# Altium schematic sheet thermokoppel.SchDoc
size A4; SheetNumber: 2; SheetTotal: 5
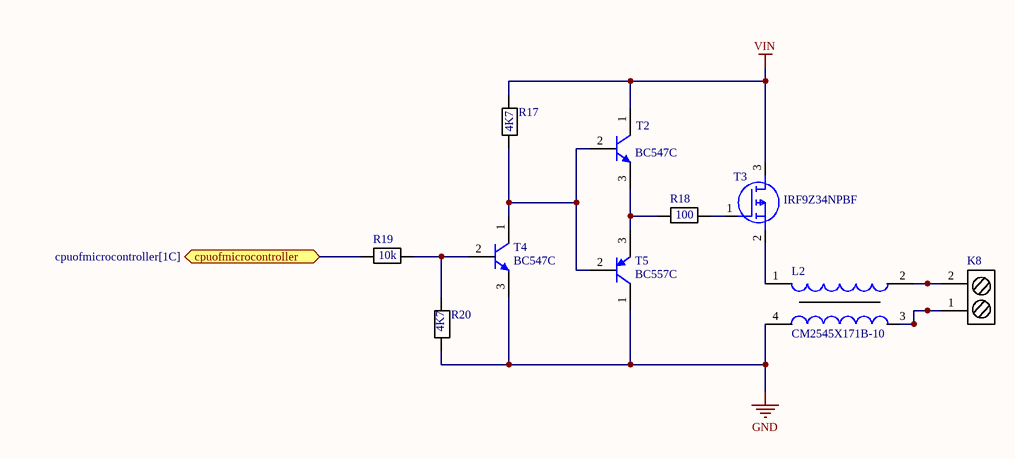
[diagram p0: thermokoppel.SchDoc]

## Parts
K8  (no value)  [printkroonsteen 2pin]
L2  CM2545X171B-10  [CM2545X171B10]
R17  4K7  [RESC2013X50X30LL20T20]
R18  100  [RESC2013X50X30LL20T20]
R19  10k  [RESC2013X50X30LL20T20]
R20  4K7  [RESC2013X50X30LL20T20]
T2  BC547C  [ONSC-TO-92-3-29-11]
T3  IRF9Z34NPBF  [TO254P469X1042X1967-3P]
T4  BC547C  [ONSC-TO-92-3-29-11]
T5  BC557C  [ONSC-TO-92-3-29-11]

## Ports
cpuofmicrocontroller (bidir, see cpuofmicrocontroller[1C])

## Nets
GND: L2.4 R20.2 T4.3(E) T5.1(C)
VIN: R17.1 T2.1(C) T3.3(D)
cpuofmicrocontroller: R19.1 ; port cpuofmicrocontroller
NetK8_1: K8.1 L2.3
NetK8_2: K8.2 L2.2
NetL2_1: L2.1 T3.2(S)
NetR17_2: R17.2 T2.2(B) T4.1(C) T5.2(B)
NetR18_1: R18.1 T2.3(E) T5.3(E)
NetR18_2: R18.2 T3.1(G)
NetR19_2: R19.2 R20.1 T4.2(B)

## Library data of the parts
K8 = printkroonsteen 2pin
L2 = CM2545X171B-10: Transformer; Manufacturer_Name: Laird Technologies; Datasheet Link: https://datasheet.datasheetarchive.com/originals/dk/DKDS-7/122753.pdf; Height: 9.5mm; Manufacturer_Part_Number: CM2545X171B-10; Mouser Part Number: N/A; Mouser Price/Stock: https://www.mouser.co.uk/ProductDetail/Laird/CM2545X171B-10?qs=PzGy0jfpSMtNfkEypgU65A%3D%3D; Arrow Part Number: CM2545X171B-10; Arrow Price/Stock: https://www.arrow.com/en/products/cm2545x171b-10/laird-technologies
R17-R20 = weerstand: Manufacturer: Vishay Dale; Part Number: CRCW08050000Z0EA
T2 T4 = BC547C: Amplifier Transistor, NPN Silicon, 3-Pin TO-92, Bulk Box; Manufacturer: On Semiconductor; IC Continuous (A): 0.1; fT Min (MHz): 150; Mounting Technology: Through Hole; ComponentLink1URL: http://www.onsemi.com/; ComponentLink1Description: Manufacturer URL; ComponentLink3URL: http://www.onsemi.cn/pub_link/Collateral/2N6426-D.PDF; DatasheetVersion: Rev. 7; PackageVersion: Rev. AM; Packing: Bulk Box; RoHS: FALSE; Polarity: NPN; PartNumber: BC547C; ComponentLink2URL: http://www.onsemi.com/pub_link/Collateral/BC546-D.PDF; ComponentLink3Description: Package Specification; PackageDescription: 3-Pin Transistor Outline, Body 4.825 x 3.685 mm, Pitch 1.27 mm; PackageReference: TO-92-3-29-11_AM_SL; ComponentLink2Description: Datasheet
T3 = IRF9Z34NPBF: MOSFET (P-Channel); Manufacturer_Name: Infineon; Datasheet Link: https://www.infineon.com/dgdl/irf9z34npbf.pdf?fileId=5546d462533600a40153561220af1ddd; Height: 4.69mm; Manufacturer_Part_Number: IRF9Z34NPBF; Mouser Part Number: 942-IRF9Z34NPBF; Mouser Price/Stock: https://www.mouser.co.uk/ProductDetail/Infineon-Technologies/IRF9Z34NPBF?qs=9%252BKlkBgLFf16a%2FvlD%252BMCtQ%3D%3D; Arrow Part Number: IRF9Z34NPBF; Arrow Price/Stock: https://www.arrow.com/en/products/irf9z34npbf/infineon-technologies-ag?region=nac
T5 = BC557C: Amplifier Transistor, PNP Silicon, 3-Pin TO-92, Bulk Box; Manufacturer: On Semiconductor; IC Continuous (A): -0.1; Polarity: PNP; PartNumber: BC557C; PackageVersion: Rev. AM; RoHS: FALSE; PackageDescription: 3-Pin Transistor Outline, Body 4.825 x 3.685 mm, Pitch 1.27 mm; Packing: Bulk Box; ComponentLink2Description: Datasheet; DatasheetVersion: Rev. 3; ComponentLink3Description: Package Specification; Mounting Technology: Through Hole; ComponentLink2URL: http://www.onsemi.com/pub_link/Collateral/BC556B-D.PDF; ComponentLink1URL: http://www.onsemi.com/; ComponentLink1Description: Manufacturer URL; ComponentLink3URL: http://www.onsemi.cn/pub_link/Collateral/2N6426-D.PDF; PackageReference: TO-92-3-29-11_AM_SL